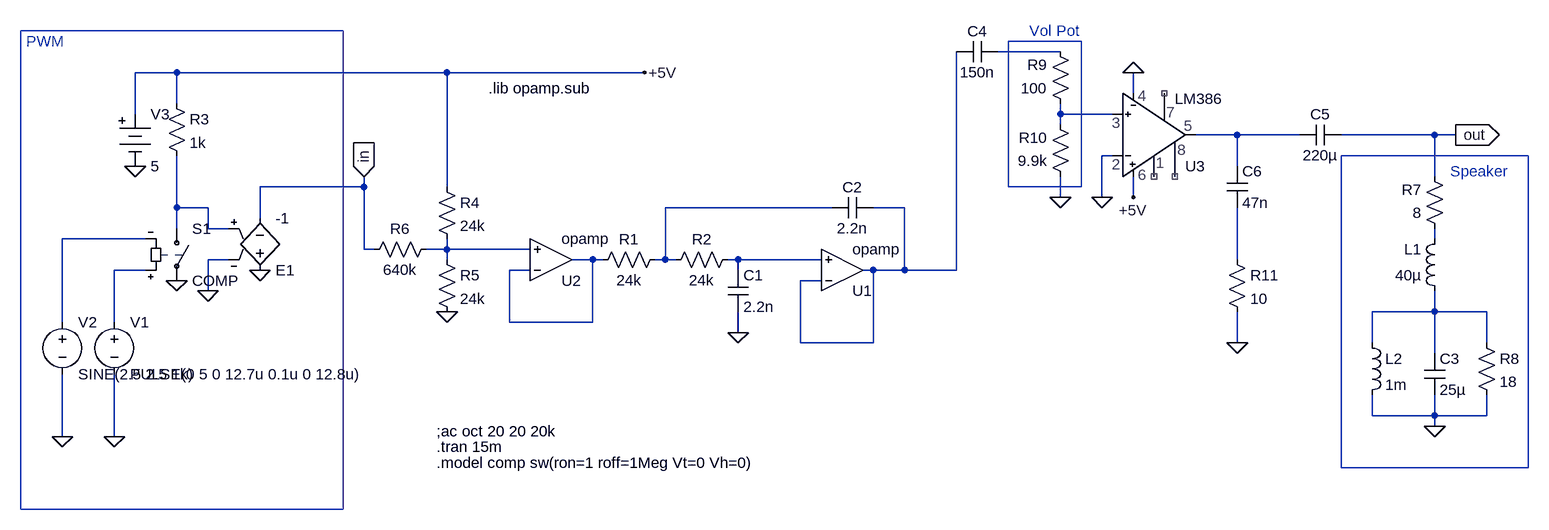
[diagram p0: schematic delta sigma.asc]
delta sigma.asc, the LTspice schematic file:
Version 4
SHEET 1 2004 740
WIRE 288 -192 192 -192
WIRE -1072 -160 -1136 -160
WIRE -656 -160 -1072 -160
WIRE -352 -160 -656 -160
WIRE 400 -128 400 -160
WIRE -1072 -112 -1072 -160
WIRE -1136 -96 -1136 -160
WIRE 288 -96 288 -112
WIRE 368 -96 288 -96
WIRE 288 -80 288 -96
WIRE 560 -64 496 -64
WIRE 656 -64 560 -64
WIRE 864 -64 720 -64
WIRE 896 -64 864 -64
WIRE 368 -32 352 -32
WIRE 560 -16 560 -64
WIRE 864 0 864 -64
WIRE -784 16 -784 0
WIRE -784 16 -944 16
WIRE -656 16 -656 -160
WIRE 288 32 288 0
WIRE 352 32 352 -32
WIRE 400 32 400 0
WIRE -1072 48 -1072 -32
WIRE -1024 48 -1072 48
WIRE -64 48 -320 48
WIRE 48 48 0 48
WIRE -944 64 -944 16
WIRE -1072 80 -1072 48
WIRE -1024 80 -1024 48
WIRE -992 80 -1024 80
WIRE -1120 96 -1248 96
WIRE 864 96 864 80
WIRE -784 112 -784 16
WIRE -768 112 -784 112
WIRE -656 112 -656 96
WIRE -656 112 -688 112
WIRE -528 112 -656 112
WIRE -992 128 -1024 128
WIRE -656 128 -656 112
WIRE -432 128 -464 128
WIRE -416 128 -432 128
WIRE -320 128 -320 48
WIRE -320 128 -336 128
WIRE -304 128 -320 128
WIRE -208 128 -224 128
WIRE -80 128 -208 128
WIRE 560 128 560 48
WIRE -1120 144 -1168 144
WIRE -528 144 -560 144
WIRE -208 144 -208 128
WIRE 0 144 -16 144
WIRE 48 144 48 48
WIRE 48 144 0 144
WIRE 128 144 128 -192
WIRE 128 144 48 144
WIRE -80 160 -112 160
WIRE -1024 176 -1024 128
WIRE 864 208 864 176
WIRE 864 208 768 208
WIRE 944 208 864 208
WIRE -1248 224 -1248 96
WIRE -1168 224 -1168 144
WIRE -560 224 -560 144
WIRE -432 224 -432 128
WIRE -432 224 -560 224
WIRE -208 240 -208 208
WIRE -112 256 -112 160
WIRE 0 256 0 144
WIRE 0 256 -112 256
WIRE 560 256 560 208
WIRE 768 256 768 208
WIRE 944 256 944 208
WIRE 864 272 864 208
WIRE 768 368 768 336
WIRE 864 368 864 336
WIRE 864 368 768 368
WIRE 944 368 944 336
WIRE 944 368 864 368
WIRE 864 384 864 368
WIRE -1248 400 -1248 304
WIRE -1168 400 -1168 304
FLAG -208 240 0
FLAG 896 -64 out
IOPIN 896 -64 Out
FLAG -1168 400 0
FLAG -1248 400 0
FLAG -1072 160 0
FLAG -1136 -16 0
FLAG -784 0 in
IOPIN -784 0 In
FLAG -1024 176 0
FLAG -944 144 0
FLAG -656 208 0
FLAG 864 384 0
FLAG 288 32 0
FLAG 352 32 0
FLAG -352 -160 +5V
FLAG 400 32 +5V
FLAG 400 -160 0
FLAG 560 256 0
SYMBOL res -320 112 R90
WINDOW 0 0 56 VBottom 0
WINDOW 3 32 56 VTop 0
SYMATTR InstName R1
SYMATTR Value 24k
SYMBOL res -208 112 R90
WINDOW 0 0 56 VBottom 0
WINDOW 3 32 56 VTop 0
SYMATTR InstName R2
SYMATTR Value 24k
SYMBOL cap -224 144 R0
SYMATTR InstName C1
SYMATTR Value 2.2n
SYMBOL cap 0 32 R90
WINDOW 0 0 32 VBottom 0
WINDOW 3 32 32 VTop 0
SYMATTR InstName C2
SYMATTR Value 2.2n
SYMBOL Opamps\\opamp -48 208 M180
SYMATTR InstName U1
SYMBOL voltage -1168 208 R0
WINDOW 123 0 0 Left 0
WINDOW 39 0 0 Left 0
SYMATTR InstName V1
SYMATTR Value PULSE(0 5 0 12.7u 0.1u 0 12.8u)
SYMBOL voltage -1248 208 R0
WINDOW 123 0 0 Left 0
WINDOW 39 0 0 Left 0
SYMATTR InstName V2
SYMATTR Value SINE(2.5 2.5 1k)
SYMBOL sw -1072 64 R0
SYMATTR InstName S1
SYMATTR Value COMP
SYMBOL Misc\\battery -1136 -112 R0
WINDOW 123 0 0 Left 0
WINDOW 39 0 0 Left 0
SYMATTR InstName V3
SYMATTR Value 5
SYMBOL res -1088 -128 R0
SYMATTR InstName R3
SYMATTR Value 1k
SYMBOL e2 -944 160 M180
SYMATTR InstName E1
SYMATTR Value -1
SYMBOL res -672 0 R0
SYMATTR InstName R4
SYMATTR Value 24k
SYMBOL res -672 112 R0
SYMATTR InstName R5
SYMATTR Value 24k
SYMBOL res -672 96 R90
WINDOW 0 0 56 VBottom 0
WINDOW 3 32 56 VTop 0
SYMATTR InstName R6
SYMATTR Value 640k
SYMBOL Opamps\\opamp -496 192 M180
SYMATTR InstName U2
SYMBOL res 880 96 R180
WINDOW 0 36 76 Left 0
WINDOW 3 36 40 Left 0
SYMATTR InstName R7
SYMATTR Value 8
SYMBOL ind 880 192 R180
WINDOW 0 36 80 Left 0
WINDOW 3 36 40 Left 0
SYMATTR InstName L1
SYMATTR Value 40µ
SYMBOL ind 752 240 R0
SYMATTR InstName L2
SYMATTR Value 1m
SYMBOL cap 848 272 R0
SYMATTR InstName C3
SYMATTR Value 25µ
SYMBOL res 928 240 R0
SYMATTR InstName R8
SYMATTR Value 18
SYMBOL lm386 416 0 M180
SYMATTR InstName U3
SYMBOL res 304 -96 R180
WINDOW 0 36 76 Left 0
WINDOW 3 36 40 Left 0
SYMATTR InstName R9
SYMATTR Value 100
SYMBOL res 304 16 R180
WINDOW 0 36 76 Left 0
WINDOW 3 36 40 Left 0
SYMATTR InstName R10
SYMATTR Value 9.9k
SYMBOL cap 128 -176 R270
WINDOW 0 32 32 VTop 0
WINDOW 3 0 32 VBottom 0
SYMATTR InstName C4
SYMATTR Value 150n
SYMBOL cap 720 -80 R90
WINDOW 0 0 32 VBottom 0
WINDOW 3 32 32 VTop 0
SYMATTR InstName C5
SYMATTR Value 220µ
SYMBOL res 544 112 R0
SYMATTR InstName R11
SYMATTR Value 10
SYMBOL cap 544 -16 R0
SYMATTR InstName C6
SYMATTR Value 47n
TEXT -592 -136 Left 0 !.lib opamp.sub
TEXT -672 392 Left 0 !;ac oct 20 20 20k
TEXT -672 416 Left 0 !.tran 15m
TEXT -672 440 Left 0 !.model comp sw(ron=1 roff=1Meg Vt=0 Vh=0)
TEXT 888 -8 Left 0 ;Speaker
TEXT -1304 -208 Left 0 ;PWM
TEXT 240 -224 Left 0 ;Vol Pot
RECTANGLE Normal 1008 448 720 -32
RECTANGLE Normal -816 512 -1312 -224
RECTANGLE Normal 320 16 208 -208

The netlist it stands for:
* delta sigma.asc
R1 N005 N010 24k
R2 N011 N005 24k
C1 N011 0 2.2n
C2 N006 N005 2.2n
XU1 N006 N011 N006 opamp Aol=100K GBW=10Meg  ; pins invin noninvin out
V1 N013 0 PULSE(0 5 0 12.7u 0.1u 0 12.8u)
V2 N007 0 SINE(2.5 2.5 1k)
S1 N004 0 N013 N007 COMP
V3 +5V 0 5
R3 +5V N004 1k
E1 0 in N004 0 -1
R4 +5V N009 24k
R5 N009 0 24k
R6 N009 in 640k
XU2 N010 N009 N010 opamp Aol=100K GBW=10Meg  ; pins invin noninvin out
R7 N008 out 8
L1 N014 N008 40µ
L2 N014 0 1m
C3 N014 0 25µ
R8 N014 0 18
XU3 0 N002 NC_01 NC_02 NC_03 N003 +5V 0 LM386  ; pins In- In+ B COMP2 V+ OUT COMP1 V-
R9 N002 N001 100
R10 0 N002 9.9k
C4 N006 N001 150n
C5 out N003 220µ
R11 N012 0 10
C6 N003 N012 47n
.lib opamp.sub
;ac oct 20 20 20k
.tran 15m
.model comp sw(ron=1 roff=1Meg Vt=0 Vh=0)
* Speaker
* PWM
* Vol Pot
.lib LM386.sub
.backanno
.end